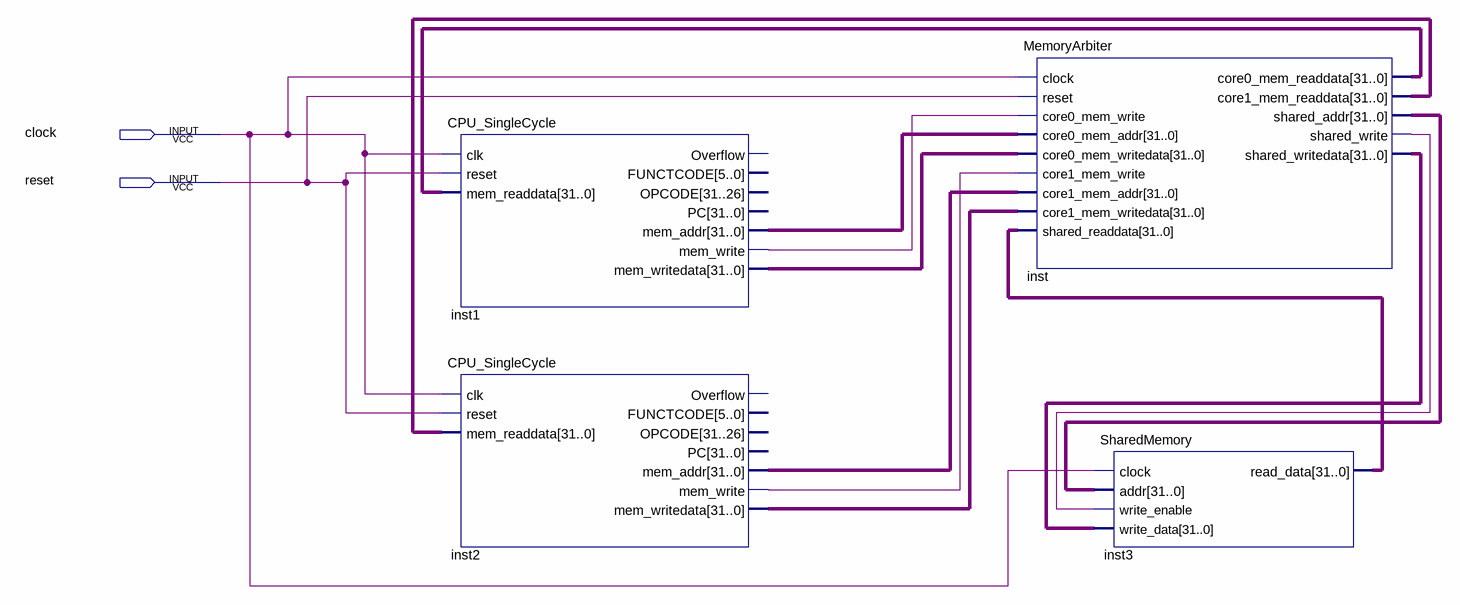
[diagram p0: schematic sheet]
// Quartus schematic DualCoreCPU.bdf as structural Verilog: 4 symbols, 2 pins
module DualCoreCPU (
  input  clock,
  input  reset
);

  wire inst1_mem_write, inst2_mem_write, inst_shared_write;
  wire [31:0] inst1_mem_addr, inst1_mem_writedata, inst2_mem_addr, inst2_mem_writedata, inst3_read_data,
       inst_core0_mem_readdata, inst_core1_mem_readdata, inst_shared_addr, inst_shared_writedata;

  CPU_SingleCycle inst1 (
    .clk(clock), .reset(reset), .mem_readdata(inst_core0_mem_readdata), .mem_addr(inst1_mem_addr),
    .mem_write(inst1_mem_write), .mem_writedata(inst1_mem_writedata));  // open: Overflow, FUNCTCODE, OPCODE, PC
  CPU_SingleCycle inst2 (
    .clk(clock), .reset(reset), .mem_readdata(inst_core1_mem_readdata), .mem_addr(inst2_mem_addr),
    .mem_write(inst2_mem_write), .mem_writedata(inst2_mem_writedata));  // open: Overflow, FUNCTCODE, OPCODE, PC
  MemoryArbiter inst (
    .clock(clock), .reset(reset), .core0_mem_write(inst1_mem_write), .core0_mem_addr(inst1_mem_addr),
    .core0_mem_writedata(inst1_mem_writedata), .core1_mem_write(inst2_mem_write),
    .core1_mem_addr(inst2_mem_addr), .core1_mem_writedata(inst2_mem_writedata),
    .shared_readdata(inst3_read_data), .core0_mem_readdata(inst_core0_mem_readdata),
    .core1_mem_readdata(inst_core1_mem_readdata), .shared_addr(inst_shared_addr),
    .shared_write(inst_shared_write), .shared_writedata(inst_shared_writedata));
  SharedMemory inst3 (
    .clock(clock), .addr(inst_shared_addr), .write_enable(inst_shared_write),
    .write_data(inst_shared_writedata), .read_data(inst3_read_data));
endmodule
